# EAGLE design ESP8266 (EAGLE 7.5.0)
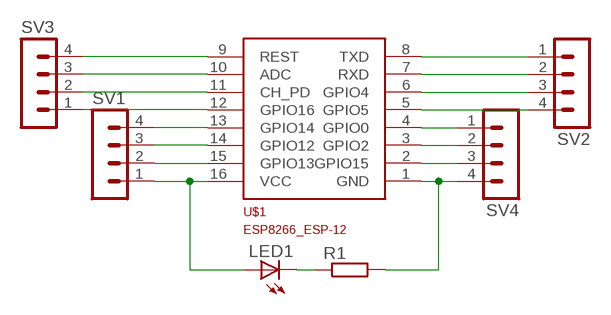
[diagram p0: schematic, sheet 1]

## Parts
LED1  LEDSML0805  [SML0805]
R1  R-EU_R0805  [R0805]
SV1  MA04-1  [MA04-1]
SV2  MA04-1  [MA04-1]
SV3  MA04-1  [MA04-1]
SV4  MA04-1  [MA04-1]
U$1  ESP8266_ESP-12  [ESP8266-ESP12]

## Nets
N$1: LED1.A SV1.1 U$1.16(VCC)
N$2: SV1.2 U$1.15(GPIO13)
N$3: SV1.3 U$1.14(GPIO12)
N$4: SV1.4 U$1.13(GPIO14)
N$5: SV3.1 U$1.12(GPIO16)
N$6: SV3.2 U$1.11(CH_PD)
N$7: SV3.3 U$1.10(ADC)
N$8: SV3.4 U$1.9(REST)
N$9: R1.2 SV4.4 U$1.1(GND)
N$10: SV4.3 U$1.2(GPIO15)
N$11: SV4.2 U$1.3(GPIO2)
N$12: SV4.1 U$1.4(GPIO0)
N$13: SV2.4 U$1.5(GPIO5)
N$14: SV2.3 U$1.6(GPIO4)
N$15: SV2.2 U$1.7(RXD)
N$16: SV2.1 U$1.8(TXD)
N$17: LED1.C R1.1

## Library data of the parts
LED1 = led:LED: LED OSRAM: - CHIPLED LG R971, LG N971, LY N971, LG Q971, LY Q971, LO R971, LY R971 LH N974, LH R974 LS Q976, LO Q976, LY Q976 LO Q996 - Hyper CHIPLED LW Q18S LB Q993, LB Q99A, LB R99A - SideLED LS A670, LO A670, LY A670, LG A670, LP A670 LB A673, LV A673, LT A673, LW A673 LH A674 LY A675 LS A676, LA A676, LO A676, LY A676, LW A676 LS A679, LY A679, LG A679 - Hyper Micro SIDELED® LS Y876, LA Y876, LO Y876, LY Y876 LT Y87S - SmartLED LW L88C, LW L88S LB L89C, LB L89S, LG L890 LS L89K, LO L89K, LY L89K LS L896, LA L896, LO L896, LY L896 - TOPLED LS T670, LO T670, LY T670, LG T670, LP T670 LSG T670, LSP T670, LSY T670, LOP T670, LYG T670 LG T671, LOG T671, LSG T671 LB T673, LV T673, LT T673, LW T673 LH T674 LS T676, LA T676, LO T676, LY T676, LB T676, LH T676, LSB T676, LW T676 LB T67C, LV T67C, LT T67C, LS T67K, LO T67K, LY T67K, LW E67C LS E67B, LA E67B, LO E67B, LY E67B, LB E67C, LV E67C, LT E67C LW T67C LS T679, LY T679, LG T679 LS T770, LO T770, LY T770, LG T770, LP T770 LB T773, LV T773, LT T773, LW T773 LH T774 LS E675, LA E675, LY E675, LS T675 LS T776, LA T776, LO T776, LY T776, LB T776 LHGB T686 LT T68C, LB T68C - Hyper Mini TOPLED® LB M676 - Mini TOPLED Santana® LG M470 LS M47K, LO M47K, LY M47K Source: http://www.osram.convergy.de LUXEON: - LUMILED® LXK2-PW12-R00, LXK2-PW12-S00, LXK2-PW14-U00, LXK2-PW14-V00 LXK2-PM12-R00, LXK2-PM12-S00, LXK2-PM14-U00 LXK2-PE12-Q00, LXK2-PE12-R00, LXK2-PE12-S00, LXK2-PE14-T00, LXK2-PE14-U00 LXK2-PB12-K00, LXK2-PB12-L00, LXK2-PB12-M00, LXK2-PB14-N00, LXK2-PB14-P00, LXK2-PB14-Q00 LXK2-PR12-L00, LXK2-PR12-M00, LXK2-PR14-Q00, LXK2-PR14-R00 LXK2-PD12-Q00, LXK2-PD12-R00, LXK2-PD12-S00 LXK2-PH12-R00, LXK2-PH12-S00 LXK2-PL12-P00, LXK2-PL12-Q00, LXK2-PL12-R00 Source: www.luxeon.com KINGBRIGHT: KA-3528ASYC Source: www.kingbright.com
R1 = resistor:R-EU_: RESISTOR, European symbol
SV1-SV4 = con-lstb:MA04-1: PIN HEADER; OC_FARNELL: unknown; OC_NEWARK: unknown
U$1 = ESP8266-ESP12:ESP8266_ESP-12

## Board
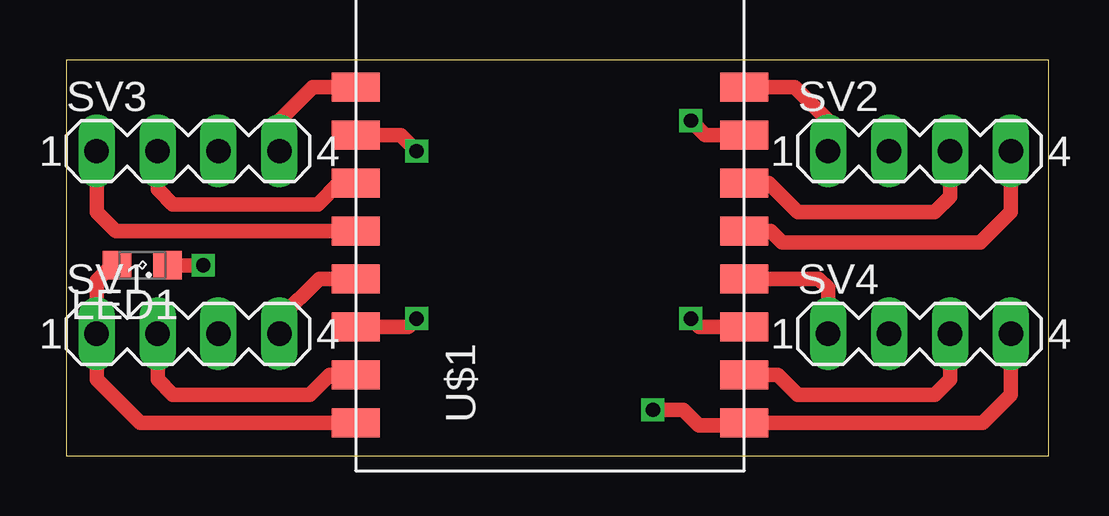
[diagram p1: board, top side]
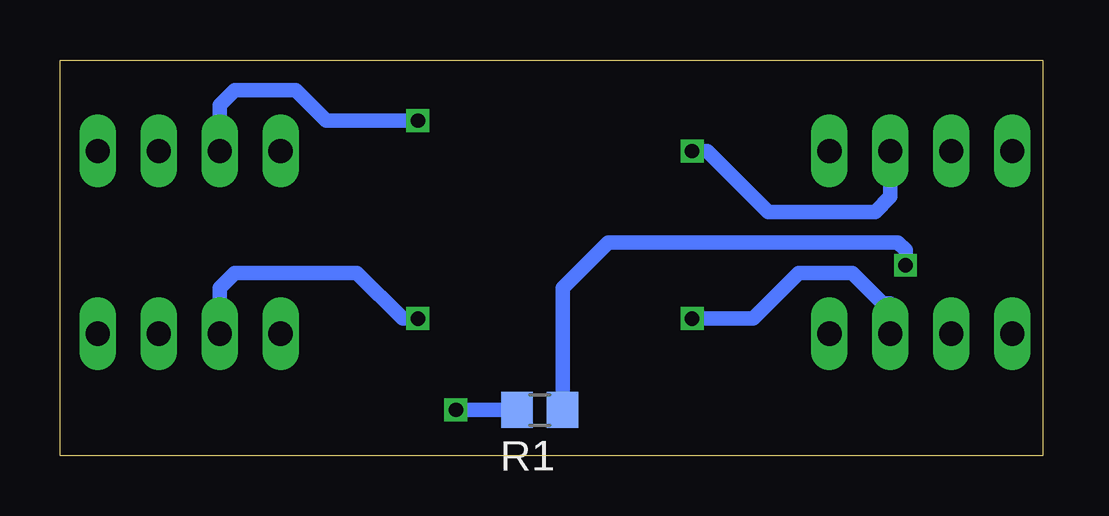
[diagram p2: board, bottom side, seen from below]

Size 40.95 x 16.5 mm. Coordinates in mm from the lower left corner, seen from the top.
Outline: 0,0 40.95,0 40.95,16.5 0,16.5 0,0
Copper layers (1*16): Top 0.0356mm / dielectric 1.5011mm / Bottom 0.0356mm
Design rules "oshpark-2layer": minimum track width 6mil, minimum drill 13mil, track to track 6mil, track to pad 6mil, pad to pad 6mil, via to via 6mil, smd to smd 6mil, copper to edge 15mil, drill to drill 6mil, minimum pad ring 7mil, minimum via ring 7mil, stop-mask expansion 2.5mil, vias tented up to drill 0mil, thermal gap 10mil

### Footprints (pad centres in the part's own frame; a part is rotated, then mirrored left to right if it is on the bottom)
SML0805 = smd 1.2 x 1.2: A 1.05,0; C -1.05,0
R0805 = smd 1.3 x 1.5: 1 -0.95,0; 2 0.95,0
MA04-1 = drill 1.016 long: 1 -3.81,0; 2 -1.27,0; 3 1.27,0; 4 3.81,0
ESP8266-ESP12 = smd 2 x 1.2: 1 16.2,2; 2 16.2,4; 3 16.2,6; 4 16.2,8; 5 16.2,10; 6 16.2,12; 7 16.2,14; 8 16.2,16; 9 0,16; 10 0,14; 11 0,12; 12 0,10; 13 0,8; 14 0,6; 15 0,4; 16 0,2

### Placement (x,y rotation side)
LED1  3.17,7.94 180 top
R1  20.95,1.91 180 bottom
SV1  5.08,5.08 0 top
SV2  35.56,12.7 0 top
SV3  5.08,12.7 0 top
SV4  35.56,5.08 0 top
U$1  12.06,-0.64 0 top

### Tracks (layer width: path | path; a pad name or v marks a point on that pad's centre or on a via)
N$1
  Top 0.61: U$1.16 3.08,1.36 1.27,3.17 SV1.1 1.27,7.3 1.91,7.94 LED1.A
N$2
  Top 0.61: U$1.15 10.98,3.37 10.16,2.54 4.45,2.54 3.81,3.17 SV1.2
N$3  (via drill 0.6)
  Top 0.61: U$1.14 14.26,5.37 v14.61,5.71
  Bottom 0.61: v14.61,5.71 12.06,5.71 10.16,7.62 7.94,7.62 6.67,6.35 6.35,6.35 SV1.3
N$4
  Top 0.61: U$1.13 10.54,7.37 8.89,5.71 SV1.4
N$5
  Top 0.61: U$1.12 2.06,9.37 1.27,10.16 SV3.1
N$6
  Top 0.61: U$1.11 11.37,11.37 10.48,10.48 4.45,10.48 3.81,11.11 SV3.2
N$7  (via drill 0.6)
  Top 0.61: U$1.10 13.94,13.37 v14.61,12.7
  Bottom 0.61: v14.61,12.7 13.97,12.7 11.43,10.16 6.99,10.16 6.35,10.79 SV3.3
N$8
  Top 0.61: U$1.9 10.29,15.37 8.89,13.97 SV3.4
N$9  (via drill 0.6)
  Top 0.61: SV4.4 39.37,2.54 38.2,1.36 U$1.1 28.17,1.27 26.35,1.27 25.72,1.91 v24.45,1.91
  Bottom 0.61: R1.2 v24.45,1.91
N$10
  Top 0.61: U$1.2 29.66,3.37 30.48,2.54 36.2,2.54 36.83,3.17 SV4.3
N$11  (via drill 0.6)
  Top 0.61: U$1.3 26.39,5.37 v26.04,5.71
  Bottom 0.61: v26.04,5.71 26.67,5.71 28.57,7.62 33.66,7.62 34.29,6.99 SV4.2
N$12
  Top 0.61: U$1.4 31.37,7.37 31.75,6.99 SV4.1
N$13
  Top 0.61: U$1.5 29.37,9.37 29.84,8.89 38.1,8.89 39.37,10.16 SV2.4
N$14
  Top 0.61: U$1.6 29.27,11.37 30.48,10.16 36.2,10.16 36.83,10.79 SV2.3
N$15  (via drill 0.6)
  Top 0.61: U$1.7 26.64,13.37 v26.04,13.97
  Bottom 0.61: v26.04,13.97 29.84,13.97 31.11,15.24 33.66,15.24 34.29,14.61 SV2.2
N$16
  Top 0.61: U$1.8 30.36,15.37 31.75,13.97 SV2.1
N$17  (via drill 0.6)
  Top 0.61: LED1.C v5.71,7.94
  Bottom 0.61: R1.1 20,6.99 18.1,8.89 6.03,8.89 5.71,8.57 v5.71,7.94